# EAGLE schematic bicicletta (EAGLE 6.1)
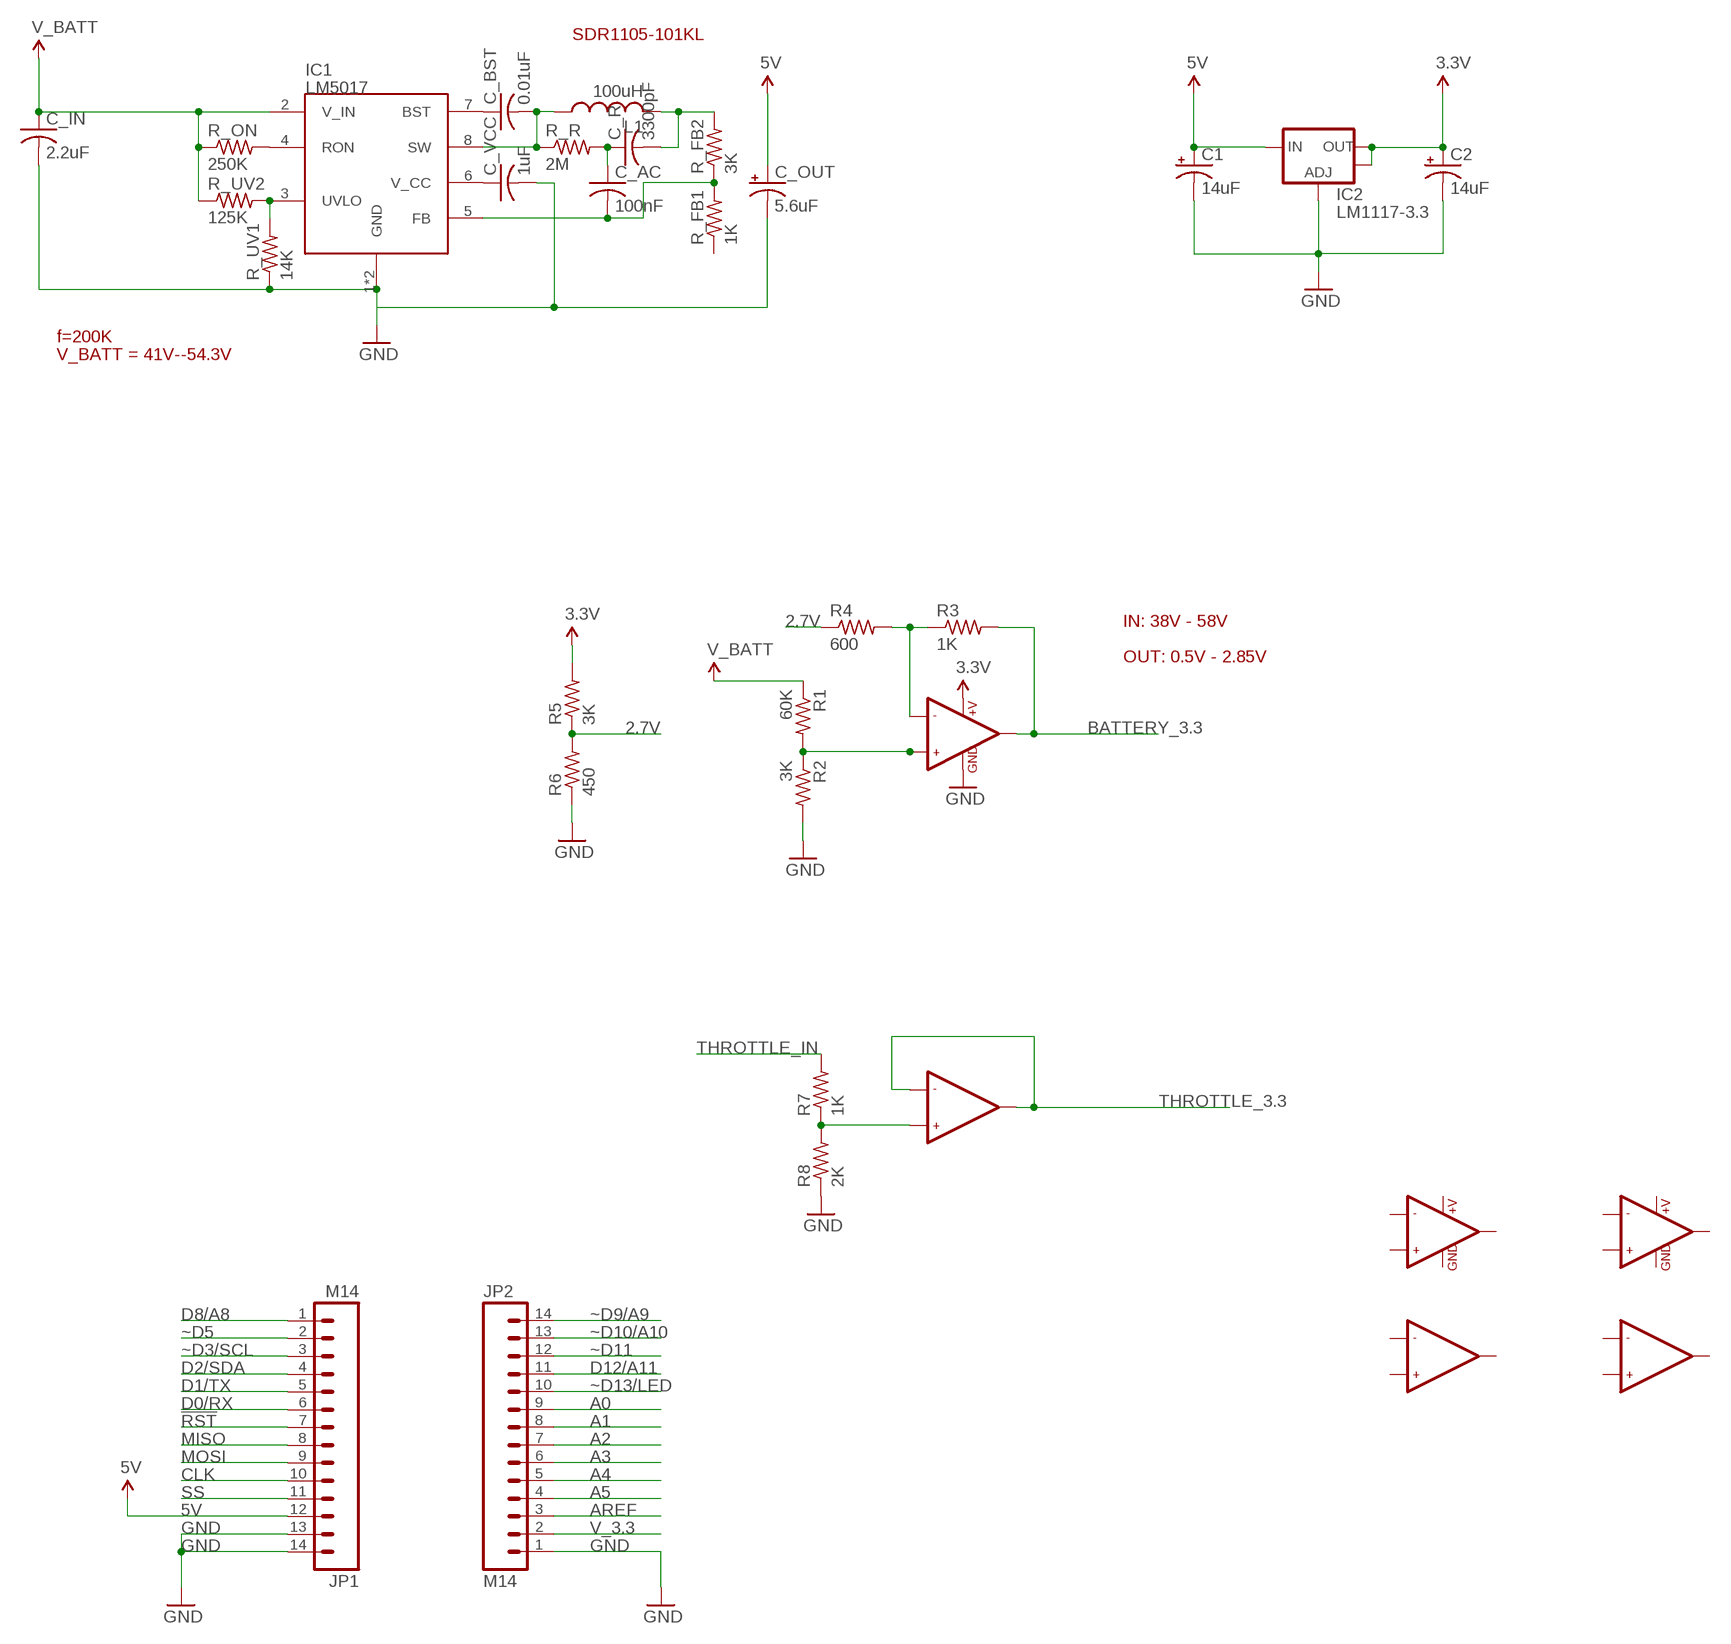
[diagram p0: schematic, sheet 1]

## Parts
C1  14uF  CPOL-USUD-5X5,8  [UD-5X5,8_NICHICON]
C2  14uF  CPOL-USUD-5X5,8  [UD-5X5,8_NICHICON]
C_AC  100nF  C-USC0603  [C0603]
C_BST  0.01uF  C-USC0603  [C0603]
C_IN  2.2uF  C-USC1210K  [C1210K]
C_OUT  5.6uF  CPOL-USUD-5X5,8  [UD-5X5,8_NICHICON]
C_R  3300pF  C-USC0603  [C0603]
C_VCC  1uF  C-USC0603  [C0603]
IC1  LM5017  [SOIC-8-POWERPAD]
IC2  LM1117-3.3  V_REG_LM1117SOT223  [SOT223]
JP1  M14  [1X14]
JP2  M14  [1X14]
L1  100uH  L-USL1812  [L1812]
R1  60K  R-US_M0805  [M0805]
R2  3K  R-US_M0805  [M0805]
R3  1K  R-US_M0805  [M0805]
R4  600  R-US_M0805  [M0805]
R5  3K  R-US_M0805  [M0805]
R6  450  R-US_M0805  [M0805]
R7  1K  R-US_M0805  [M0805]
R8  2K  R-US_M0805  [M0805]
R_FB1  1K  R-US_M0805  [M0805]
R_FB2  3K  R-US_M0805  [M0805]
R_ON  250K  R-US_M0805  [M0805]
R_R  2M  R-US_M0805  [M0805]
R_UV1  14K  R-US_M0805  [M0805]
R_UV2  125K  R-US_M0805  [M0805]
U$1  LMV358  [SO08]
U$2  LMV358  [SO08]
U$3  LMV358  [SO08]

## Nets
2.7V: R4.1 R5.1 R6.2
3.3V: C2.+ IC2.2(OUT) IC2.4(OUT) R5.2 U$1.8(+V)
5V: C1.+ C_OUT.+ IC2.3(IN) JP1.12
!RST: JP1.7
A0: JP2.9
A1: JP2.8
A2: JP2.7
A3: JP2.6
A4: JP2.5
A5: JP2.4
AREF: JP2.3
BATTERY_3.3: R3.2 U$1.1(OUT1)
CLK: JP1.10
D0/RX: JP1.6
D1/TX: JP1.5
D2/SDA: JP1.4
D8/A8: JP1.1
D12/A11: JP2.11
GND: C1.- C2.- C_IN.2 C_OUT.- C_VCC.2 IC1.1(GND) IC1.P$1(GND) IC2.1(ADJ) JP1.13 JP1.14 JP2.1 R2.2 R6.1 R8.1 R_UV1.1 U$1.4(GND)
MISO: JP1.8
MOSI: JP1.9
N$1: IC1.4(RON) R_ON.2
N$2: C_AC.2 IC1.5(FB) R_FB1.2 R_FB2.1
N$3: IC1.3(UVLO) R_UV1.2 R_UV2.2
N$4: C_BST.2 IC1.8(SW) L1.1 R_R.1
N$5: C_R.2 L1.2 R_FB2.2
N$6: C_AC.1 C_R.1 R_R.2
N$7: C_BST.1 IC1.7(BST)
N$8: R1.2 R2.1 U$1.3(+IN1)
N$9: C_VCC.1 IC1.6(V_CC)
N$10: R3.1 R4.2 U$1.2(-IN1)
N$11: R7.1 R8.2 U$1.5(+IN2)
SS: JP1.11
THROTTLE_3.3: U$1.6(-IN2) U$1.7(OUT2)
THROTTLE_IN: R7.2
V_3.3: JP2.2
V_BATT: C_IN.1 IC1.2(V_IN) R1.1 R_ON.1 R_UV2.1
~D3/SCL: JP1.3
~D5: JP1.2
~D9/A9: JP2.14
~D10/A10: JP2.13
~D11: JP2.12
~D13/LED: JP2.10
Unconnected: R_FB1.1 U$2.1(OUT1) U$2.2(-IN1) U$2.3(+IN1) U$2.5(+IN2) U$2.6(-IN2) U$2.7(OUT2) U$3.1(OUT1) U$3.2(-IN1) U$3.3(+IN1) U$3.5(+IN2) U$3.6(-IN2) U$3.7(OUT2)

## Notes on the sheet
- SDR1105-101KL
- f=200K
- V_BATT = 41V--54.3V
- IN: 38V - 58V
- OUT: 0.5V - 2.85V

## Power pins joined to a net without a drawn wire
+V: U$2.8(+V) U$3.8(+V)
GND: U$2.4(GND) U$3.4(GND)

## Library data of the parts
C1 C2 C_OUT = rcl:CPOL-US: POLARIZED CAPACITOR, American symbol
C_AC C_BST C_IN C_R C_VCC = rcl:C-US: CAPACITOR, American symbol
IC1 = Railstars:LM5017
IC2 = SparkFun-PowerIC:V_REG_LM1117: Voltage Regulator LM1117 Standard adjustable voltage regulator but in SMD form. Spark Fun Electronics SKU : COM-00595
JP1 JP2 = SparkFun-Connectors:M14: Header 14 Standard 14-pin 0.1" header. Use with straight break away headers (SKU : PRT-00116), right angle break away headers (PRT-00553), swiss pins (PRT-00743), machine pins (PRT-00117), and female headers (PRT-00115).
L1 = rcl:L-US: INDUCTOR, American symbol
R1-R8 R_FB1 R_FB2 R_ON R_R R_UV1 R_UV2 = rcl:R-US_: RESISTOR, American symbol
U$1-U$3 = SparkFun-AnalogIC:LMV358: Jellybean rail-to-rail output op-amp